# Altium schematic sheet RF.SchDoc
size A4
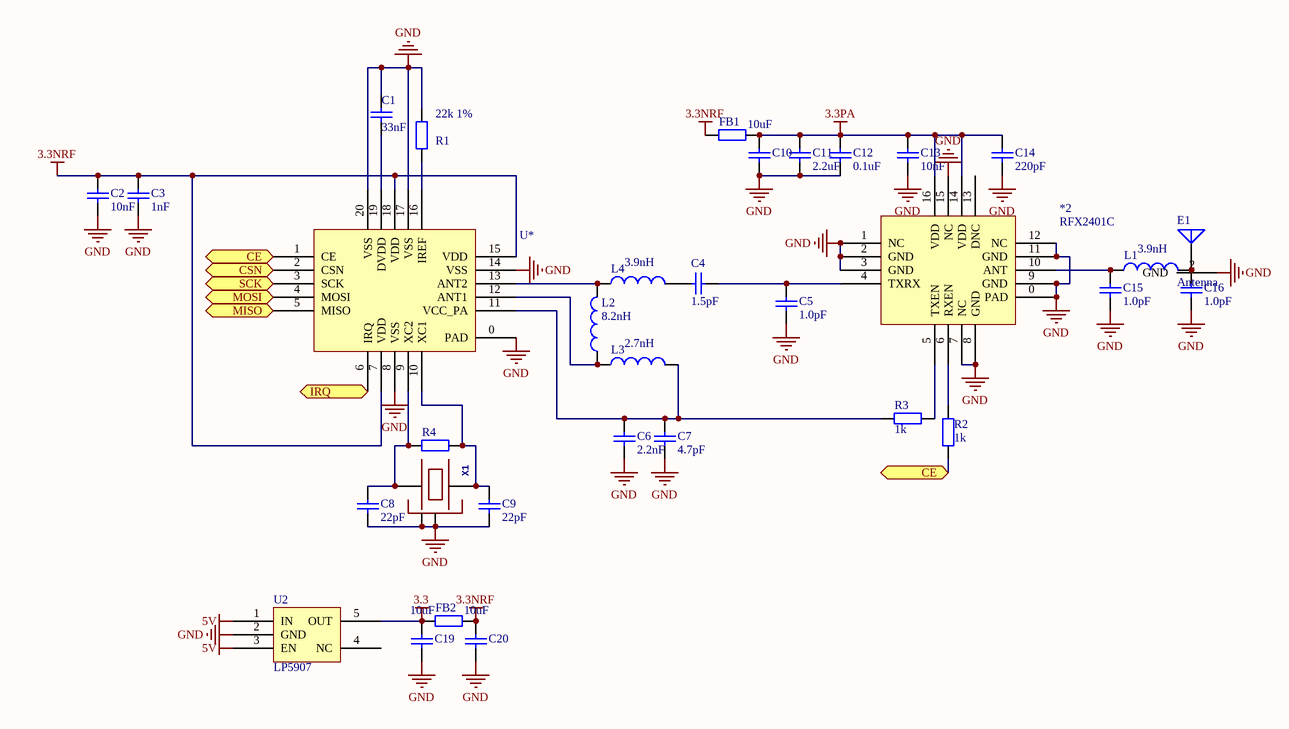
[diagram p0: RF.SchDoc]

## Parts
*2  RFX2401C  [RFX2401C]
C1  value 33nF  [0402]  (hidden comment: Cap)
C2  value 10nF  [0402]  (hidden comment: Cap)
C3  value 1nF  [0402]  (hidden comment: Cap)
C4  value 1.5pF  [0402]  (hidden comment: Cap)
C5  value 1.0pF  [0402]  (hidden comment: Cap)
C6  value 2.2nF  [0402]  (hidden comment: Cap)
C7  value 4.7pF  [0402]  (hidden comment: Cap)
C8  value 22pF  [0402]  (hidden comment: Cap)
C9  value 22pF  [0402]  (hidden comment: Cap)
C10  10uF  [0603]
C11  value 2.2uF  [0402]  (hidden comment: Cap)
C12  value 0.1uF  [0402]  (hidden comment: Cap)
C13  value 10nF  [0402]  (hidden comment: Cap)
C14  value 220pF  [0402]  (hidden comment: Cap)
C15  value 1.0pF  [0402]  (hidden comment: Cap)
C16  value 1.0pF  [0402]  (hidden comment: Cap)
C19  10uF  [0603]
C20  10uF  [0603]
E1  Antenna  [IPEX]
FB1  FB  [0402]  (value not drawn)
FB2  FB  [0402]  (value not drawn)
L1  value 3.9nH  [0402]  (hidden comment: Inductor)
L2  value 8.2nH  [0402]  (hidden comment: Inductor)
L3  value 2.7nH  [0402]  (hidden comment: Inductor)
L4  value 3.9nH  [0402]  (hidden comment: Inductor)
R1  value 22k 1%  [0402]  (hidden comment: Res2)
R2  value 1k  [0402]  (hidden comment: Res2)
R3  value 1k  [0402]  (hidden comment: Res2)
R4  1M  [0402]  (value not drawn)
U2  LP5907  [SOT23-5]
U*  NRF24L01  [NRF24L01]  (value not drawn)
X1  16Mhz  [OSCILLATOR-3.2X2.5]  (value not drawn)

## Ports
CE, CSN, IRQ, MISO, MOSI, SCK

## Nets
3.3: C19.1 FB2.1 U2.5(OUT)
3.3NRF: C2.1 C3.1 C20.1 FB1.1 FB2.2 U*.7(VDD) U*.15(VDD) U*.18(VDD)
3.3PA: *2.14(VDD) *2.16(VDD) C10.1 C11.1 C12.1 C13.1 C14.1 FB1.2
5V: U2.1(IN) U2.3(EN)
GND: *2.0(PAD) *2.1(NC) *2.2(GND) *2.3(GND) *2.7(NC) *2.8(GND) *2.9(GND) *2.11(GND) *2.12(NC) *2.15(NC) C1.1 C2.2 C3.2 C5.2 C6.2 C7.2 C8.2 C9.2 C10.2 C11.2 C12.2 C13.2 C14.2 C15.2 C16.2 C19.2 C20.2 E1.2(GND) R1.1 U2.2(GND) U*.0(PAD) U*.8(VSS) U*.14(VSS) U*.17(VSS) U*.20(VSS) X1.2(NC_2) X1.4(NC_4)
CE: R2.1 U*.1(CE) ; port CE
CSN: U*.2(CSN) ; port CSN
IRQ: U*.6(IRQ) ; port IRQ
MISO: U*.5(MISO) ; port MISO
MOSI: U*.4(MOSI) ; port MOSI
SCK: U*.3(SCK) ; port SCK
Net*2_4: *2.4(TXRX) C4.2 C5.1
Net*2_5: *2.5(TXEN) R3.2
Net*2_6: *2.6(RXEN) R2.2
Net*2_10: *2.10(ANT) C15.1 L1.1
NetC1_2: C1.2 U*.19(DVDD)
NetC4_1: C4.1 L4.2
NetC6_1: C6.1 C7.1 L3.2 R3.1 U*.11(VCC_PA)
NetC8_1: C8.1 R4.1 U*.9(XC2) X1.1
NetC9_1: C9.1 R4.2 U*.10(XC1) X1.3
NetC16_1: C16.1 E1.1(ANT) L1.2
NetL2_1: L2.1 L3.1 U*.12(ANT1)
NetL2_2: L2.2 L4.1 U*.13(ANT2)
NetR1_2: R1.2 U*.16(IREF)

Not connected (* = marked no-connect by the designer): *2 13(DNC); U2 4(NC)

## Library data of the parts
C1-C16 C19 C20 = Cap: Capacitor; Published: 8-Jun-2000; LatestRevisionDate: 17-Jul-2002; LatestRevisionNote: Re-released for DXP Platform.; PackageReference: RAD-0.3; Publisher: Altium Limited; PackageDescription: Radial Cap, Thru-Hole; 2 Leads; 0.3 in Pin Spacing
E1 = Antenna: Generic Antenna; Published: 24-Mar-1999; LatestRevisionDate: 17-Jul-2002; LatestRevisionNote: Re-released for DXP Platform.; PackageReference: PIN1; Publisher: Altium Limited
FB1 FB2 R1-R3 = Res2: Resistor; Published: 8-Jun-2000; LatestRevisionDate: 17-Jul-2002; LatestRevisionNote: Re-released for DXP Platform.; PackageReference: AXIAL-0.4; Publisher: Altium Limited; PackageDescription: Axial Device, Thru-Hole; 2 Leads; 0.4 in Pin Spacing
L1-L4 = Inductor: Code_IEC: 1005; Published: 8-Jun-2000; LatestRevisionDate: 29-May-2009; LatestRevisionNote: IPC-7351 Footprint Added.; PackageReference: 0402-A; Publisher: Altium Limited; PackageDescription: Chip Inductor; Code_JEITA: 0402
R4 = Res2: Resistor; Value: 1k; Published: 8-Jun-2000; LatestRevisionDate: 17-Jul-2002; LatestRevisionNote: Re-released for DXP Platform.; PackageReference: AXIAL-0.4; Publisher: Altium Limited; PackageDescription: Axial Device, Thru-Hole; 2 Leads; 0.4 in Pin Spacing
X1 = OSCILLATOR-3.2X2.5: Crystal Oscillator in 3.2x2.5 SMD